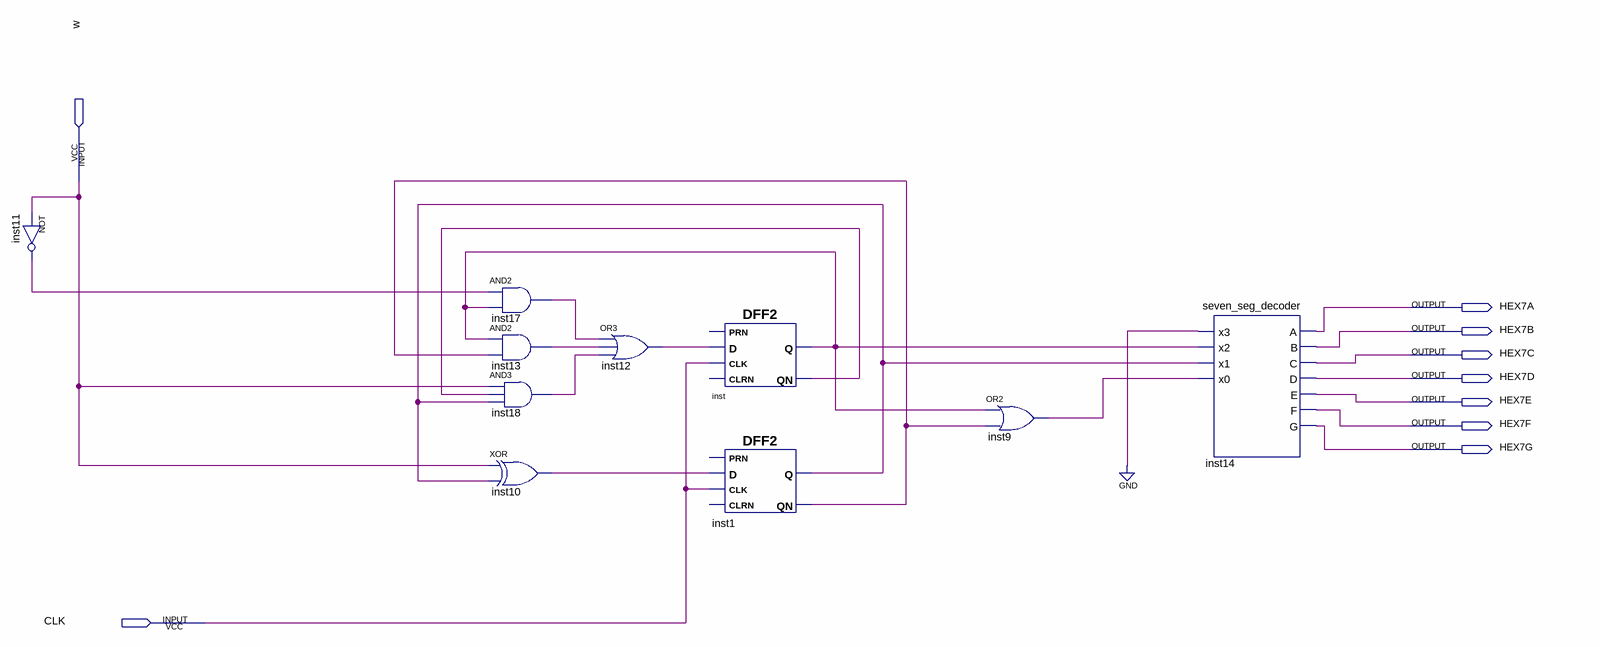
[diagram p0: schematic sheet]
// Quartus schematic lab11step2.bdf as structural Verilog: 10 symbols, 9 pins
module lab11step2 (
  input  w,
  input  CLK,
  output HEX7A,
  output HEX7B,
  output HEX7C,
  output HEX7D,
  output HEX7E,
  output HEX7F,
  output HEX7G
);

  wire inst1_q, inst1_qn, inst9_out, inst10_out, inst11_out, inst12_out, inst13_out, inst17_out, inst18_out,
       inst_q, inst_qn;

  not inst11 (inst11_out, w);
  and inst17 (inst17_out, inst11_out, inst_q);
  and inst13 (inst13_out, inst_q, inst1_qn);
  and inst18 (inst18_out, w, inst_qn, inst1_q);
  xor inst10 (inst10_out, w, inst1_q);
  or inst12 (inst12_out, inst17_out, inst13_out, inst18_out);
  DFF2 inst (.CLK(CLK), .D(inst12_out), .Q(inst_q), .QN(inst_qn));  // open: PRN, CLRN
  DFF2 inst1 (.CLK(CLK), .D(inst10_out), .Q(inst1_q), .QN(inst1_qn));  // open: PRN, CLRN
  or inst9 (inst9_out, inst_q, inst1_qn);
  seven_seg_decoder inst14 (
    .x3(1'b0), .x2(inst_q), .x1(inst1_q), .x0(inst9_out), .A(HEX7A), .B(HEX7B), .C(HEX7C), .D(HEX7D),
    .E(HEX7E), .F(HEX7F), .G(HEX7G));
endmodule
